# EAGLE design badge-inner-revA (EAGLE 9.4.0)
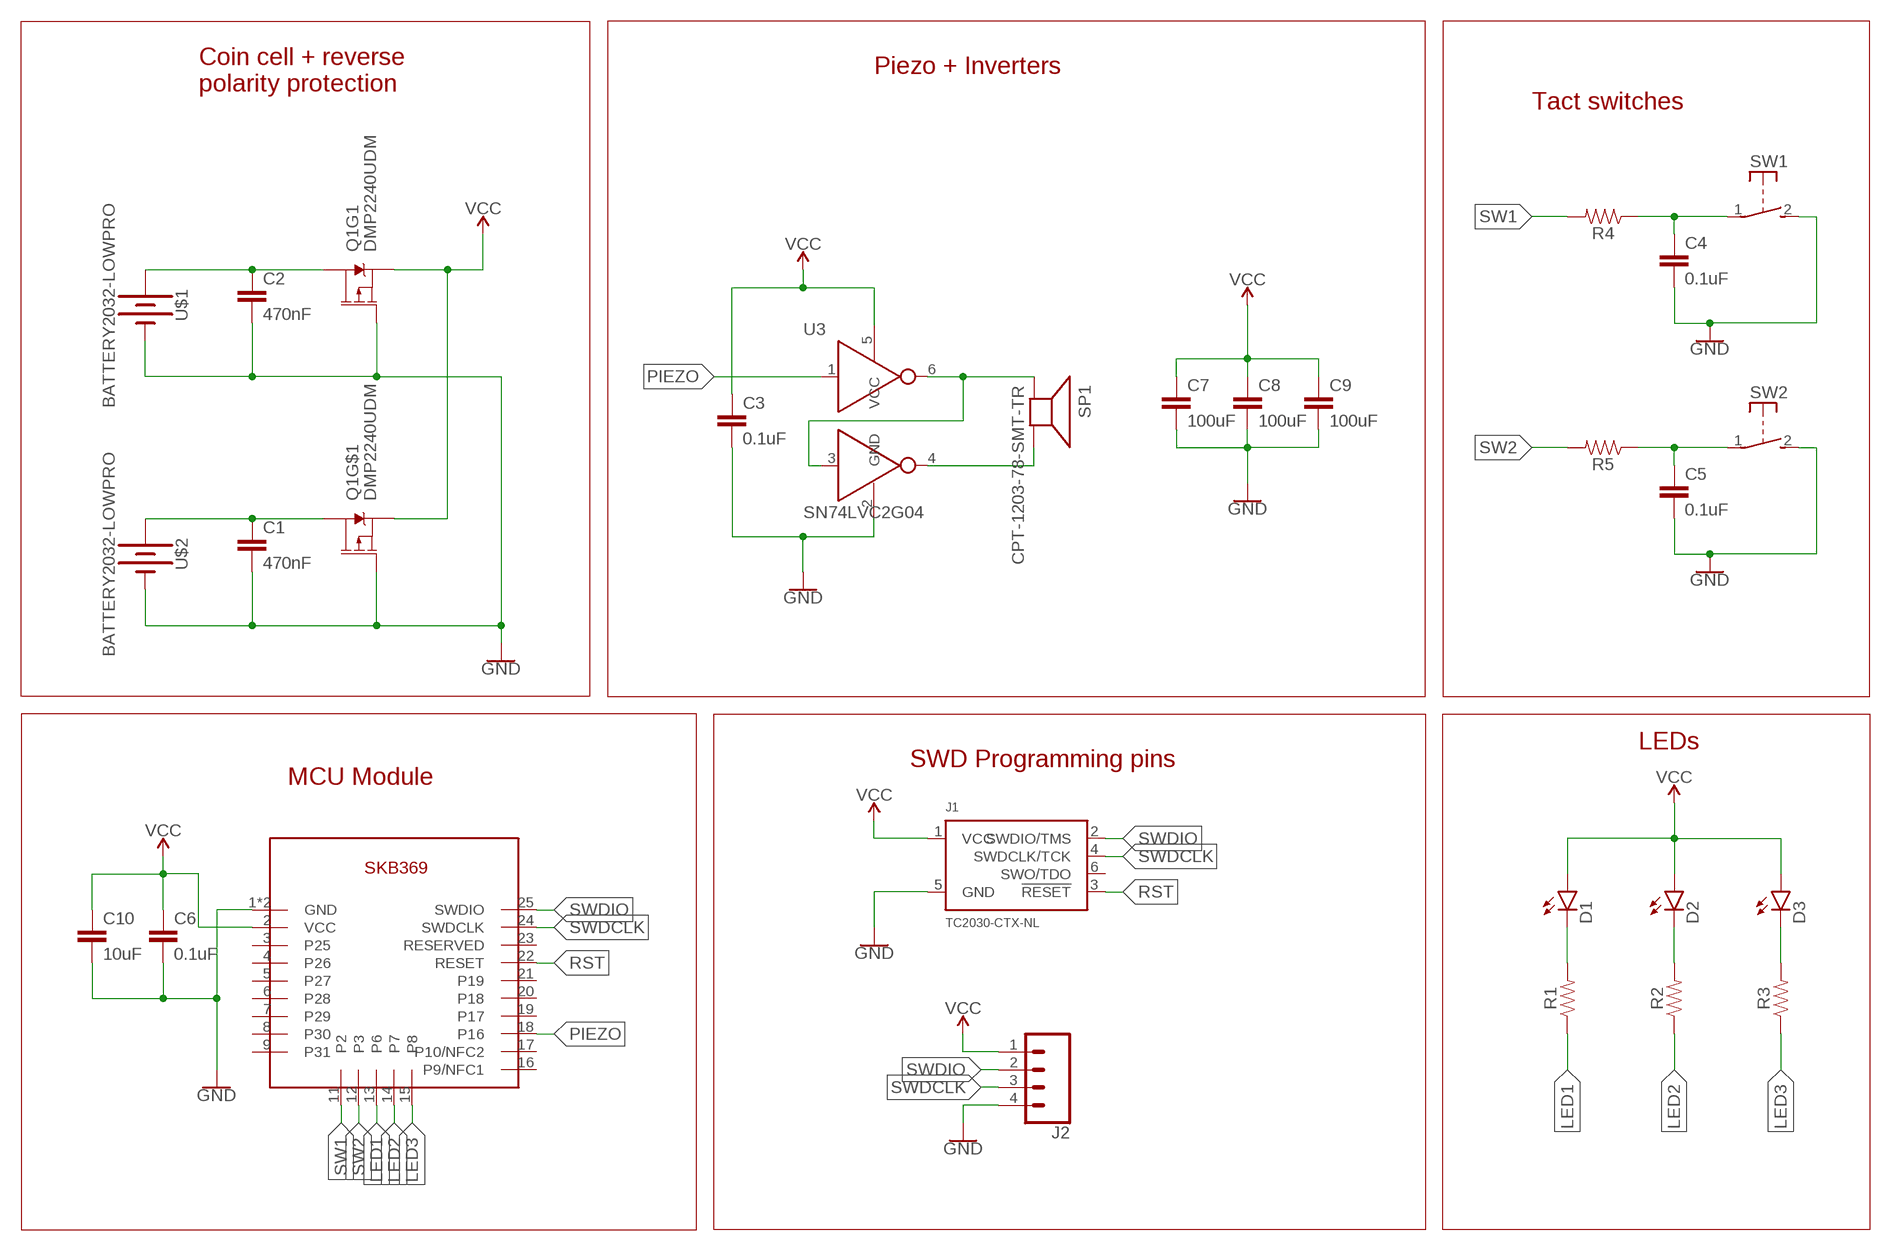
[diagram p0: schematic, sheet 1]

## Parts
C1  470nF  0.1UF-0603-25V-5%  [0603]
C2  470nF  0.1UF-0603-25V-5%  [0603]
C3  0.1uF  0.1UF-0603-25V-5%  [0603]
C4  0.1uF  0.1UF-0603-25V-5%  [0603]
C5  0.1uF  0.1UF-0603-25V-5%  [0603]
C6  0.1uF  0.1UF-0603-25V-5%  [0603]
C7  100uF  10UF-1206-6.3V-20%  [1206]
C8  100uF  10UF-1206-6.3V-20%  [1206]
C9  100uF  10UF-1206-6.3V-20%  [1206]
C10  10uF  0.1UF-0603-25V-5%  [0603]
D1  SIDE-LED  [SIDE-LED]
D2  SIDE-LED  [SIDE-LED]
D3  SIDE-LED  [SIDE-LED]
J1  TC2030-CTX-NL  [TC2030-IDC-NL]
J2  CONN_04SMD_RA_FEMALE  [1X04_SMD_RA_FEMALE]
Q1  DMP2240UDM  MOSFET_PCH_DUAL-DMP2240UDM  [SOT26]
R1  0.05OHM-0603-1/5W-1%  [0603]
R2  0.05OHM-0603-1/5W-1%  [0603]
R3  0.05OHM-0603-1/5W-1%  [0603]
R4  0.05OHM-0603-1/5W-1%  [0603]
R5  0.05OHM-0603-1/5W-1%  [0603]
SP1  CPT-1203-78-SMT-TR  SPEAKER  [CPT-1203-78-SMT-TR]
SW1  EVQP4  [EVQP4KB]
SW2  EVQP4  [EVQP4KB]
U1  SKB369  [SKB369]
U3  SN74LVC2G04  DUAL-INVERTERSN74LVC2G04  [SC70]
U$1  BATTERY2032-LOWPRO  [COINCELL20LOWPRO]
U$2  BATTERY2032-LOWPRO  [COINCELL20LOWPRO]

## Nets
GND: C1.2 C2.2 C3.2 C4.2 C5.2 C6.2 C7.2 C8.2 C9.2 C10.2 J1.5(GND) J2.4 Q1.G1(G) Q1.G2(G) SW1.2(S) SW2.2(S) U1.1(GND) U1.10(GND) U3.2(GND) U$1.P$2(-) U$2.P$2(-)
LED1: R1.1 U1.13(P6)
LED2: R2.1 U1.14(P7)
LED3: R3.1 U1.15(P8)
N$1: SP1.P$1(+) U3.3(A2) U3.6(Y1)
N$2: SP1.P$2(-) U3.4(Y2)
N$3: D1.1(C) R1.2
N$4: D2.1(C) R2.2
N$5: D3.1(C) R3.2
N$6: C2.1 Q1.D1(D) U$1.P$1(+)
N$8: C5.1 R5.1 SW2.1(P)
N$9: C1.1 Q1.D2(D) U$2.P$1(+)
N$11: C4.1 R4.1 SW1.1(P)
PIEZO: U1.18(P16) U3.1(A1)
RST: J1.3(!RESET) U1.22(RESET)
SW1: R4.2 U1.11(P2)
SW2: R5.2 U1.12(P3)
SWDCLK: J1.4(SWDCLK/TCK) J2.3 U1.24(SWDCLK)
SWDIO: J1.2(SWDIO/TMS) J2.2 U1.25(SWDIO)
VCC: C3.1 C6.1 C7.1 C8.1 C9.1 C10.1 D1.2(A) D2.2(A) D3.2(A) J1.1(VCC) J2.1 Q1.S1(S) Q1.S2(S) U1.2(VCC) U3.5(VCC)
Unconnected: J1.6(SWO/TDO) U1.3(P25) U1.4(P26) U1.5(P27) U1.6(P28) U1.7(P29) U1.8(P30) U1.9(P31) U1.16(P9/NFC1) U1.17(P10/NFC2) U1.19(P17) U1.20(P18) U1.21(P19) U1.23(RESERVED)

## Notes on the sheet
- Piezo + Inverters
- Coin cell + reverse 
  polarity protection
- Tact switches
- LEDs
- SWD Programming pins
- MCU Module

## Library data of the parts
C1 C2 C10 = SparkFun-Capacitors:0.1UF: 0.1µF ceramic capacitors A capacitor is a passive two-terminal electrical component used to store electrical energy temporarily in an electric field.; PROD_ID: CAP-08604; VALUE: 0.1uF
C3-C6 = SparkFun-Capacitors:0.1UF: 0.1µF ceramic capacitors A capacitor is a passive two-terminal electrical component used to store electrical energy temporarily in an electric field.; PROD_ID: CAP-08604
C7-C9 = SparkFun-Capacitors:10UF: 10.0µF ceramic capacitors A capacitor is a passive two-terminal electrical component used to store electrical energy temporarily in an electric field.; PROD_ID: CAP-10057; SPICEPREFIX: C; VALUE: 10uF
D1-D3 = shlomo:SIDE-LED
J1 = TC2030-CTX:TC2030-CTX: Tag Connect footprint for ARM JTAG. 10 pin ARM Cortex Debug Connector.; AVAILABILITY: Unavailable; DESCRIPTION: Cbl 10pos For Cortex Processors; MF: Tag-Connect LLC; MP: TC2030-CTX; PACKAGE: None; PRICE: None
J2 = SparkFun-Connectors:CONN_04: Multi connection point. Often used as Generic Header-pin footprint for 0.1 inch spaced/style header connections On any of the 0.1 inch spaced packages, you can populate with these: Break Away Headers - Straight <https://www.sparkfun.com/products/116> (PRT-00116) Break Away Male Headers - Right Angle <https://www.sparkfun.com/products/553> (PRT-00553) Female Headers <https://www.sparkfun.com/products/115> (PRT-00115) Break Away Headers - Machine Pin <https://www.sparkfun.com/products/117> (PRT-00117) Break Away Female Headers - Swiss Machine Pin <https://www.sparkfun.com/products/743> (PRT-00743) For SCREWTERMINALS and SPRING TERMINALS visit here: Screw Terimnals on SparkFun.com <https://www.sparkfun.com/search/results?term=Screw+Terminals> (5mm/3.5mm/2.54mm spacing) This device is also useful as a general connection point to wire up your design to another part of your project. Our various solder wires solder well into these plated through hole pads. Hook-Up Wire - Assortment (Stranded, 22 AWG) <https://www.sparkfun.com/products/11375> (PRT-11375) Hook-Up Wire - Assortment (Solid Core, 22 AWG) <https://www.sparkfun.com/products/11367> (PRT-11367) View the entire wire category on our website here <https://www.sparkfun.com/categories/141> Special notes: Molex polarized connector foot print use with SKU : PRT-08231 with associated crimp pins and housings. 1MM SMD Version SKU: PRT-10208; PROD_ID: CONN-12382
Q1 = SparkFun-DiscreteSemi:MOSFET_PCH_DUAL: Dual P-Channel -20VDS MOSFET Link to datasheet <http://www.diodes.com/_files/datasheets/ds31197.pdf> SparkFun Products: SparkFun FreeSoC2 Development Board <https://www.sparkfun.com/products/13229>; PROD_ID: TRANS-12444; VALUE: 2A/20V/150mΩ
R1-R5 = SparkFun-Resistors:0.05OHM: 0.05Ω resistor A resistor is a passive two-terminal electrical component that implements electrical resistance as a circuit element. Resistors act to reduce current flow, and, at the same time, act to lower voltage levels within circuits. - Wikipedia; PROD_ID: RES-12535; VALUE: 0.05
SP1 = shlomo:SPEAKER
SW1 SW2 = shlomo:EVQP4
U1 = shlomo:SKB369
U3 = shlomo:DUAL-INVERTER
U$1 U$2 = shlomo:BATTERY

## Board
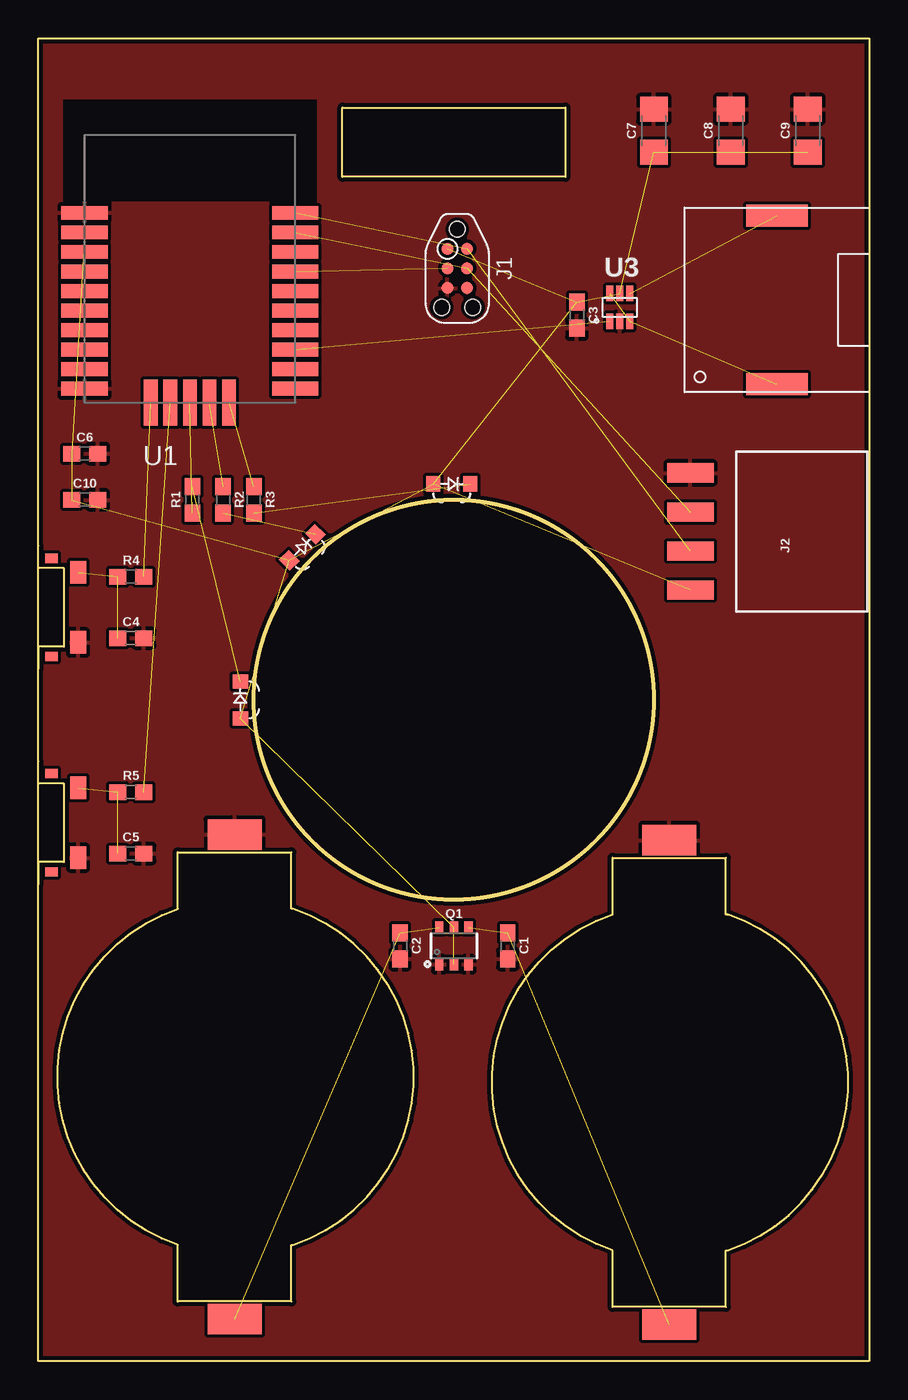
[diagram p1: board, top side]

Size 54 x 86 mm. Coordinates in mm from the lower left corner, seen from the top.
Outline: circle at 27,43 radius 13
Copper layers (1*16): Top 0.035mm / dielectric 1.5mm / Bottom 0.035mm
Design rules "SparkFun": minimum track width 8mil, minimum drill 20mil, track to track 8mil, track to pad 8mil, pad to pad 8mil, via to via 8mil, smd to smd 8mil, copper to edge 10mil, drill to drill 8mil, minimum pad ring 12mil, minimum via ring 10mil, stop-mask expansion 4mil, vias tented up to drill 25mil, thermal gap 10mil

### Footprints (pad centres in the part's own frame; a part is rotated, then mirrored left to right if it is on the bottom)
0603 = smd 1.1 x 1: 1 -0.85,0; 2 0.85,0
1206 = smd 1.6 x 1.8: 1 -1.4,0; 2 1.4,0
SIDE-LED = smd 0.9 x 1: 1 -1.2,0; 2 1.2,0
TC2030-IDC-NL = smd 0.787 x 0.787: 1 -1.27,-0.635; 2 -1.27,0.635; 3 0,-0.635; 4 0,0.635; 5 1.27,-0.635; 6 1.27,0.635 | hole 1.016: -2.54,0; 2.54,1.016; 2.54,-1.016
1X04_SMD_RA_FEMALE = smd 1.25 x 3: 1 -3.81,7.225; 2 -1.27,7.225; 3 1.27,7.225; 4 3.81,7.225
SOT26 = smd 0.55 x 0.8: D1 -0.95,1.2; D2 0.95,1.2; G1 -0.95,-1.2; G2 0.95,-1.2; S1 0,1.2; S2 0,-1.2
CPT-1203-78-SMT-TR = smd 4 x 1.45: P$1 0,5.475; P$2 0,-5.475
EVQP4KB = smd 1.45 x 1.05: 1 -2.275,2.575; 2 2.275,2.575 | smd 0.6 x 0.8: P$1 -3.2,0.85; P$2 3.2,0.85
SKB369 = smd 0.9 x 3: 1 4.71,6.85; 2 3.44,6.85; 3 2.17,6.85; 4 0.9,6.85; 5 -0.37,6.85; 6 -1.64,6.85; 7 -2.91,6.85; 8 -4.18,6.85; 9 -5.45,6.85; 10 -6.72,6.85; 16 -6.72,-6.85; 17 -5.45,-6.85; 18 -4.18,-6.85; 19 -2.91,-6.85; 20 -1.64,-6.85; 21 -0.37,-6.85; 22 0.9,-6.85; 23 2.17,-6.85; 24 3.44,-6.85; 25 4.71,-6.85 | smd 3 x 0.9: 11 -7.62,2.54; 12 -7.62,1.27; 13 -7.62,0; 14 -7.62,-1.27; 15 -7.62,-2.54
SC70 = smd 0.44 x 1: 1 -0.65,-0.9; 2 0,-0.9; 3 0.65,-0.9; 4 0.65,0.9; 5 0,0.9; 6 -0.65,0.9
COINCELL20LOWPRO = smd 2 x 3.5: P$1 -15.748,0; P$2 15.748,0

### Placement (x,y rotation side)
C1  30.5,27 270 top
C2  23.5,27 270 top
C3  35,68 270 top
C4  6,47 0 top
C5  6,33 0 top
C6  3,59 0 top
C7  40,80 90 top
C8  45,80 90 top
C9  50,80 90 top
C10  3,56 0 top
D1  13.12,42.99 270 top
D2  17.15,52.92 225 top
D3  26.86,57.03 180 top
J1  27.22,71.05 270 top
J2  49.61,53.94 90 top
Q1  27,27 0 top
R1  10,56 90 top
R2  12,56 270 top
R3  14,56 270 top
R4  6,51 0 top
R5  6,37 0 top
SP1  48,69 180 top
SW1  0,49 270 top
SW2  0,35 270 top
U1  9.85,69.95 90 top
U3  37.78,68.51 0 top
U$1  12.75,18.48 90 top
U$2  41,18.12 90 top
U$3  [KEYCARD]  27,43 0 top

### Tracks (layer width: path | path; a pad name or v marks a point on that pad's centre or on a via)
GND
  pour Top: -1,87 55,87 55,-2 -1,-2
LED1  (1 unrouted)
LED2  (1 unrouted)
LED3  (1 unrouted)
N$1  (2 unrouted)
N$2  (1 unrouted)
N$3  (1 unrouted)
N$4  (1 unrouted)
N$5  (1 unrouted)
N$6  (2 unrouted)
N$8  (2 unrouted)
N$9  (2 unrouted)
N$11  (2 unrouted)
PIEZO  (1 unrouted)
RST  (1 unrouted)
SW1  (1 unrouted)
SW2  (1 unrouted)
SWDCLK  (2 unrouted)
SWDIO  (2 unrouted)
VCC  (14 unrouted)